# Altium schematic sheet TIDA-01592_Power Supply1.SchDoc: Power Supply
size 431 x 279 mm; Date: Not shown in title block; ApprovedBy: Not shown in title block; CheckedBy: Not shown in title block; Author: Not shown in title block; CompanyName: Not shown in title block; DrawnBy: Abhishek Vishwa; Engineer: Abhishek Vishwa; Organization: Not shown in title block; Address1: Not shown in title block; Address2: Not shown in title block; Address3: Not shown in title block; Address4: Not shown in title block; DocumentNumber: 1; Revision: Use project parameter SCH_Rev; SheetNumber: 2; SheetTotal: 5; PageSetup: Record=PageOptions|CenterHorizontal=True|CenterVertical=True|PrintScale=1.00|XCorrection=1.00|YCorrection=1.00|PrintKind=0|BorderSize=5000000|LeftOffset=0|BottomOffset=0|Orientation=2|PaperLength=1000|PaperWidth=1000|Scale=100|PaperSource=15|PrintQuality=600|MediaType=1|DitherType=10|PaperKind=Letter|PrintScaleMode=1; CurrentTime: Not shown in title block; CurrentDate: Not shown in title block; Time: Not shown in title block; DocumentFullPathAndName: Not shown in title block; DocumentName: Not shown in title block; ModifiedDate: Not shown in title block; ImagePath: Not shown in title block; ProjectName: HV PS for Transmitter
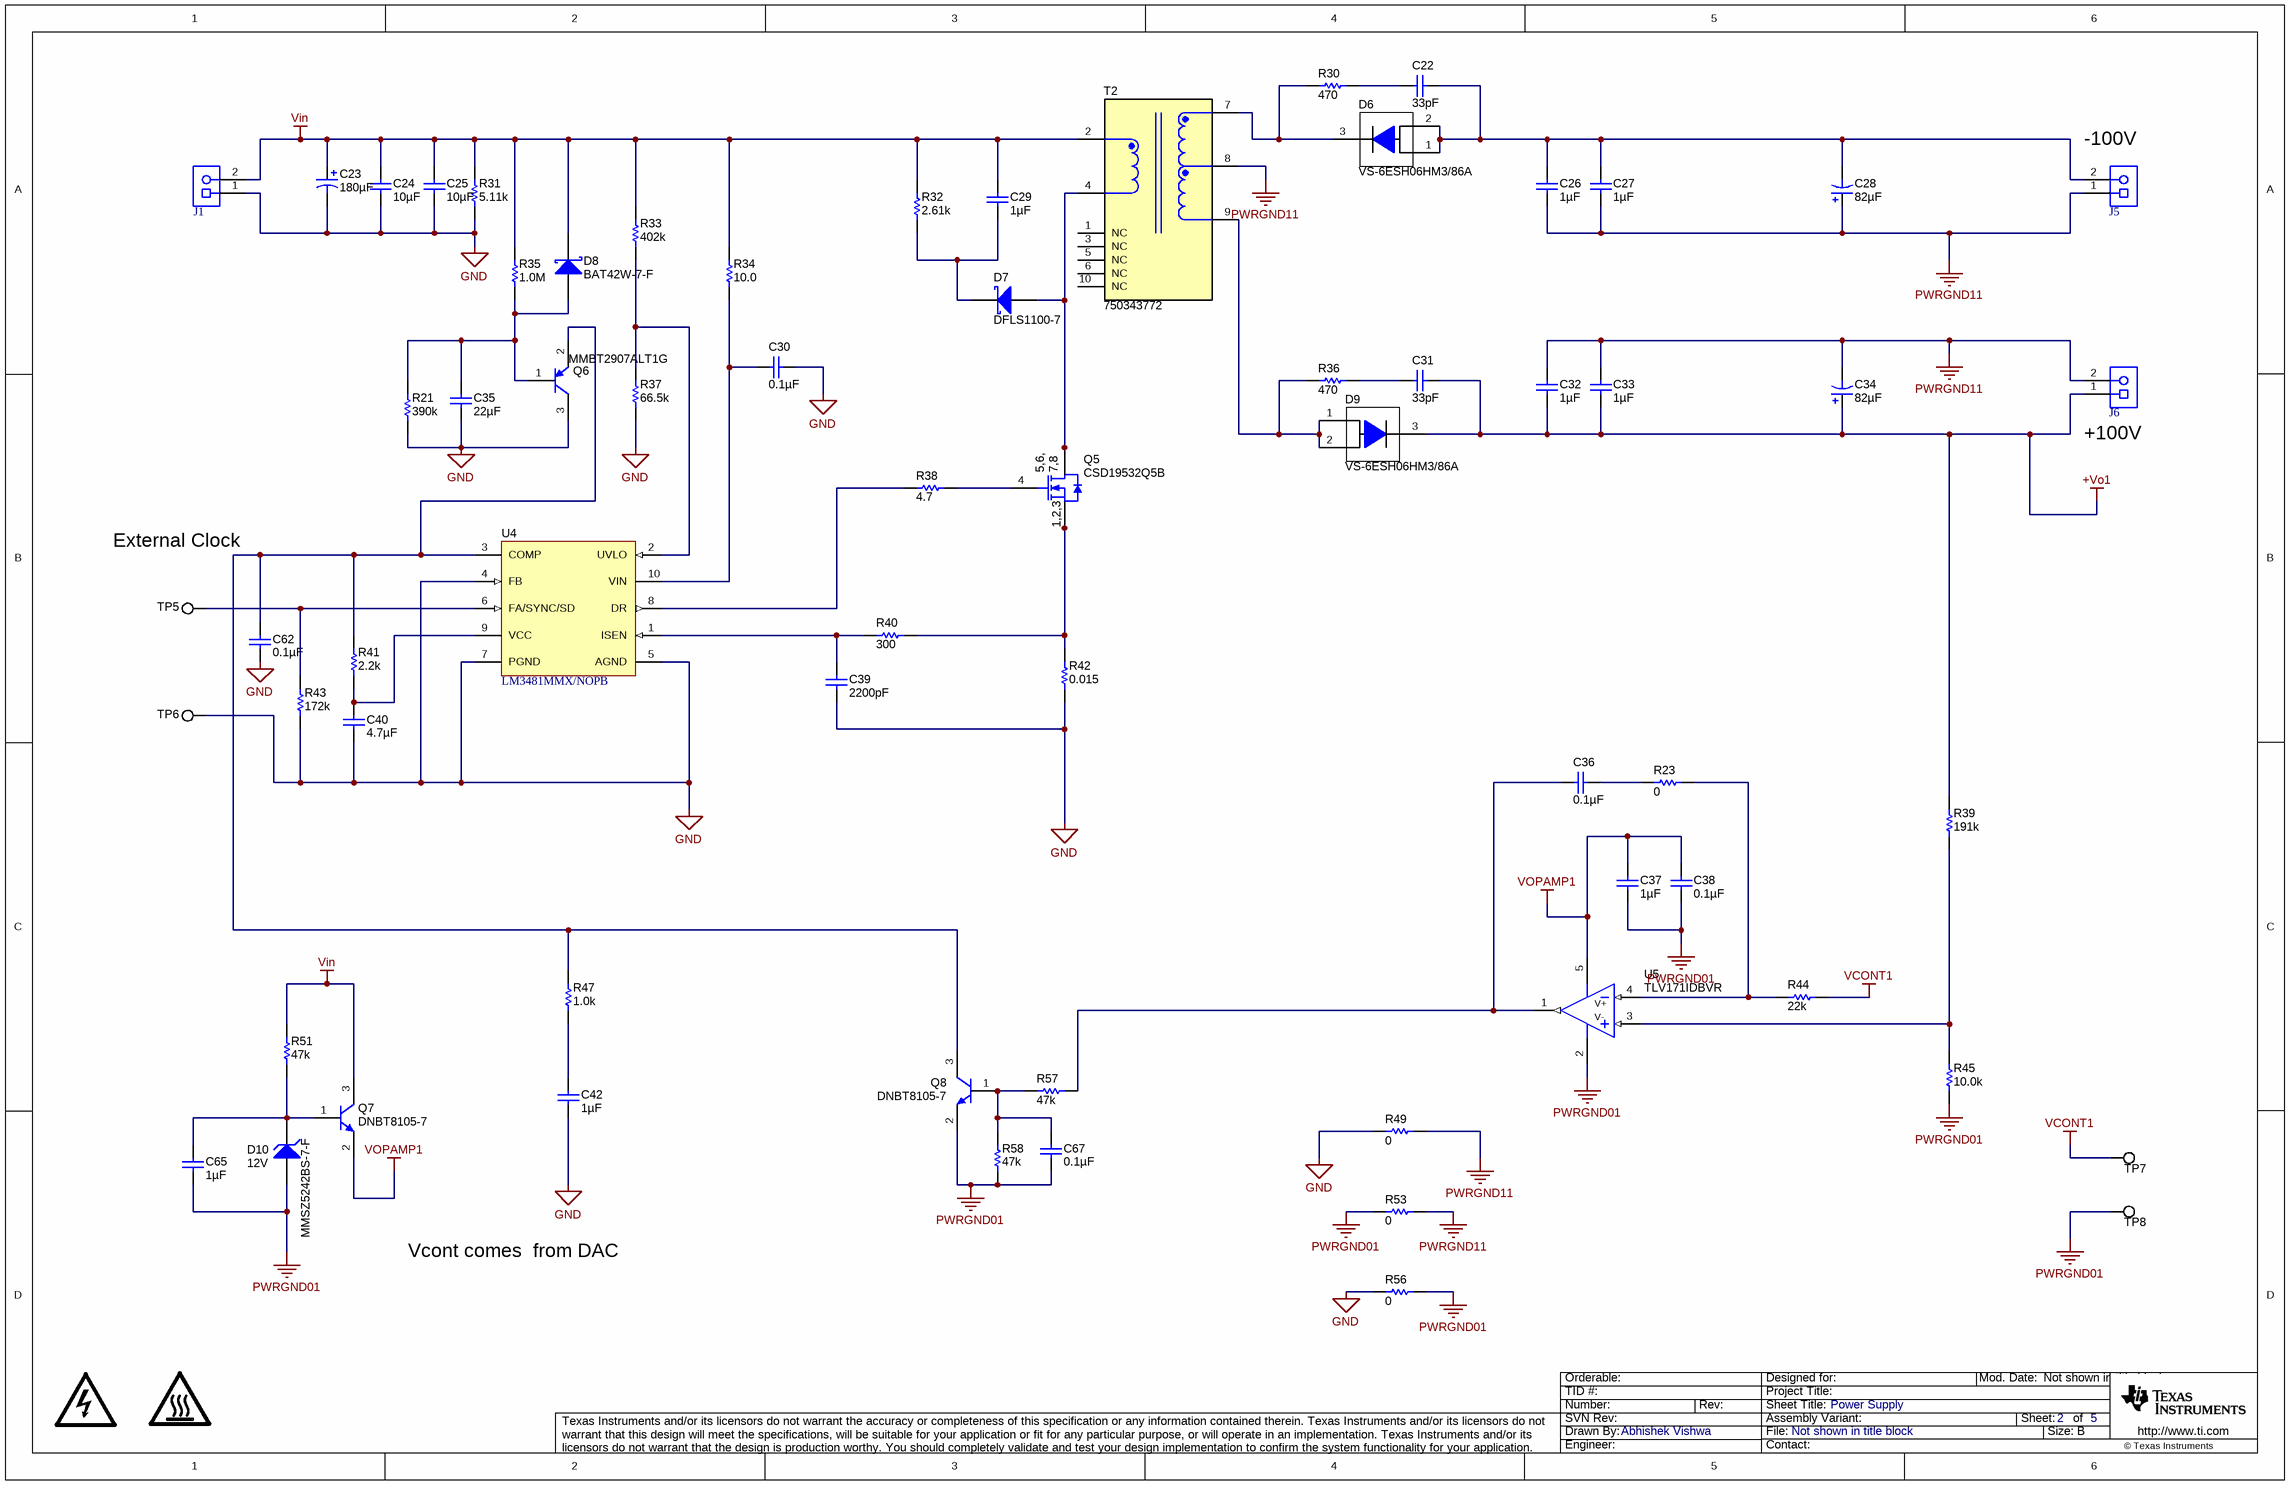
[diagram p0: TIDA-01592_Power Supply1.SchDoc]

## Parts
C22  ValueDisplayed: 33pF  [1206]  (hidden comment: 12067A330JAT2A)
C23  ValueDisplayed: 180µF  [FC_630x1120]  (hidden comment: 35TXW180MEFC6.3X25)
C24  ValueDisplayed: 10µF  [1206_180]  (hidden comment: GRM31CR61H106KA12L)
C25  ValueDisplayed: 10µF  [1206_180]  (hidden comment: GRM31CR61H106KA12L)
C26  ValueDisplayed: 1µF  [1812_180]  (hidden comment: C4532X7T2E105M250KE)
C27  ValueDisplayed: 1µF  [1812_180]  (hidden comment: C4532X7T2E105M250KE)
C28  ValueDisplayed: 82µF  [NHG_1000x2000]  (hidden comment: UCY2C820MPD9)
C29  ValueDisplayed: 1µF  [1206_180]  (hidden comment: GRM31CR72A105KA01L)
C30  ValueDisplayed: 0.1µF  [0603]  (hidden comment: GRM188R71H104KA93D)
C31  ValueDisplayed: 33pF  [1206]  (hidden comment: 12067A330JAT2A)
C32  ValueDisplayed: 1µF  [1812_180]  (hidden comment: C4532X7T2E105M250KE)
C33  ValueDisplayed: 1µF  [1812_180]  (hidden comment: C4532X7T2E105M250KE)
C34  ValueDisplayed: 82µF  [NHG_1000x2000]  (hidden comment: UCY2C820MPD9)
C35  ValueDisplayed: 22µF  [0805_HV1]  (hidden comment: C2012X5R1V226M125AC)
C36  ValueDisplayed: 0.1µF  [0603]  (hidden comment: GRM188R71H104KA93D)
C37  ValueDisplayed: 1µF  [0603]  (hidden comment: UMK107AB7105KA-T)
C38  ValueDisplayed: 0.1µF  [0603]  (hidden comment: GRM188R71H104KA93D)
C39  ValueDisplayed: 2200pF  [0402]  (hidden comment: GRM155R61H222KA01D)
C40  ValueDisplayed: 4.7µF  [0603]  (hidden comment: 0603ZD475KAT2A)
C42  ValueDisplayed: 1µF  [0603]  (hidden comment: C0603C105K3RACTU)
C62  ValueDisplayed: 0.1µF  [0603]  (hidden comment: GRM188R71H104KA93D)
C65  ValueDisplayed: 1µF  [0603]  (hidden comment: C0603C105K3RACTU)
C67  ValueDisplayed: 0.1µF  [0603]  (hidden comment: GRM188R71H104KA93D)
D6  VS-6ESH06HM3/86A  [TO-277A]
D7  DFLS1100-7  [PowerDI123]
D8  BAT42W-7-F  [SOD-123]
D9  VS-6ESH06HM3/86A  [TO-277A]
D10  MMSZ5242BS-7-F  value 12V  [SOD-323]
J1  1727010  [PhoenixConact_1727010]  (value not drawn)
J5  1727010  [PhoenixConact_1727010]  (value not drawn)
J6  1727010  [PhoenixConact_1727010]  (value not drawn)
LOGO2  CAUTION HOT SURFACE  [IEC_HotSurface_Small]  (value not drawn)  (graphical)
LOGO8  DANGER HIGH VOLTAGE  [IEC_HighVoltage_Small]  (value not drawn)  (graphical)
Q5  CSD19532Q5B  [DNK0008A]
Q6  MMBT2907ALT1G  [SOT-23]
Q7  DNBT8105-7  [SOT-23]
Q8  DNBT8105-7  [SOT-23]
R21  ValueDisplayed: 390k  [0603]  (hidden comment: CRCW0603390KJNEA)
R23  ValueDisplayed: 0  [0402]  (hidden comment: CRCW04020000Z0ED)
R30  ValueDisplayed: 470  [1206]  (hidden comment: CRCW1206470RJNEA)
R31  ValueDisplayed: 5.11k  [TNPW0603]  (hidden comment: TNPW06035K11BEEA)
R32  ValueDisplayed: 2.61k  [2010]  (hidden comment: CRCW20102K61FKEF)
R33  ValueDisplayed: 402k  [0603]  (hidden comment: CRCW0603402KFKEA)
R34  R4: 10.0  [0603]  (hidden comment: CRCW060310R0FKEAHP)
R35  ValueDisplayed: 1.0M  [0603]  (hidden comment: CRCW06031M00JNEA)
R36  ValueDisplayed: 470  [1206]  (hidden comment: CRCW1206470RJNEA)
R37  ValueDisplayed: 66.5k  [0603]  (hidden comment: CRCW060366K5FKEA)
R38  ValueDisplayed: 4.7  [0603]  (hidden comment: CRCW06034R70JNEA)
R39  ValueDisplayed: 191k  [0603]  (hidden comment: CRCW0603191KFKEA)
R40  ValueDisplayed: 300  [0603]  (hidden comment: CRCW0603300RJNEA)
R41  ValueDisplayed: 2.2k  [0603]  (hidden comment: ERJ-3GEYJ222V)
R42  ValueDisplayed: 0.015  [2010]  (hidden comment: WSL2010R0150FEA18)
R43  ValueDisplayed: 172k  [0603]  (hidden comment: RT0603DRE07172KL)
R44  ValueDisplayed: 22k  [0603]  (hidden comment: CRCW060322K0JNEA)
R45  ValueDisplayed: 10.0k  [0603]  (hidden comment: CRCW060310K0FKEA)
R47  ValueDisplayed: 1.0k  [0603]  (hidden comment: CRCW06031K00JNEA)
R49  ValueDisplayed: 0  [2010L]  (hidden comment: CRCW20100000Z0EF)
R51  ValueDisplayed: 47k  [1206]  (hidden comment: CRCW120647K0JNEA)
R53  ValueDisplayed: 0  [2010L]  (hidden comment: CRCW20100000Z0EF)
R56  ValueDisplayed: 0  [2010L]  (hidden comment: CRCW20100000Z0EF)
R57  ValueDisplayed: 47k  [0603]  (hidden comment: RC0603JR-0747KL)
R58  ValueDisplayed: 47k  [0603]  (hidden comment: RC0603JR-0747KL)
T2  750343772  [Wurth_EE16_7_5_5278]
TP5  5002  [Keystone5002]  (value not drawn)
TP6  5002  [Keystone5002]  (value not drawn)
TP7  5002  [Keystone5002]  (value not drawn)
TP8  5002  [Keystone5002]  (value not drawn)
U4  LM3481MMX/NOPB  [MUB10A_N]
U5  TLV171IDBVR  [DBV0005A_N]

## Nets
+Vo1: C31.1 C32.2 C33.2 C34.1(+) D9.3(K) J6.1 R39.2
GND: C23.2(-) C24.2 C25.2 C30.1 C35.2 C39.2 C40.2 C42.2 C62.1 J1.1 Q6.3(C) R21.1 R31.1 R37.1 R42.1 R43.1 R49.1 R56.1 TP6.1 U4.4(FB) U4.5(AGND) U4.7(PGND)
PWRGND01: C37.2 C38.2 C65.2 C67.1 D10.2(A) Q8.2(E) R45.2 R53.1 R56.2 R58.2 TP8.1 U5.2(V-)
PWRGND11: C26.2 C27.2 C28.1(+) C32.1 C33.1 C34.2(-) J5.1 J6.2 R49.2 R53.2 T2.8
VCONT1: R44.2 TP7.1
Vin: C23.1(+) C24.1 C25.1 C29.1 D8.1(K) J1.2 Q7.3(C) R31.2 R32.2 R33.2 R34.1 R35.2 R51.2 T2.2
VOPAMP1: C37.1 C38.1 Q7.2(E) U5.5(V+)
NetC22_1: C22.1 C26.1 C27.1 C28.2(-) D6.1(A) D6.2(A) J5.2
NetC22_2: C22.2 R30.2
NetC29_2: C29.2 D7.1(K) R32.1
NetC30_2: C30.2 R34.2 U4.10(VIN)
NetC31_2: C31.2 R36.2
NetC35_1: C35.1 D8.2(A) Q6.1(B) R21.2 R35.1
NetC36_1: C36.1 R57.1 U5.1(OUT)
NetC36_2: C36.2 R23.1
NetC39_1: C39.1 R40.1 U4.1(ISEN)
NetC40_1: C40.1 R41.2 U4.9(VCC)
NetC42_1: C42.1 R47.1
NetC62_2: C62.2 Q6.2(E) Q8.3(C) R41.1 R47.2 U4.3(COMP)
NetC65_1: C65.1 D10.1(K) Q7.1(B) R51.1
NetC67_2: C67.2 Q8.1(B) R57.2 R58.1
NetD6_3: D6.3(K) R30.1 T2.7
NetD7_2: D7.2(A) Q5.5(D) Q5.6(D) Q5.7(D) Q5.8(D) Q5.9(D) T2.4
NetD9_1: D9.1(A) D9.2(A) R36.1 T2.9
NetQ5_1: Q5.1(S) Q5.2(S) Q5.3(S) R40.2 R42.2
NetQ5_4: Q5.4(G) R38.2
NetR23_2: R23.2 R44.1 U5.4(IN-)
NetR33_1: R33.1 R37.2 U4.2(UVLO)
NetR38_1: R38.1 U4.8(DR)
NetR39_1: R39.1 R45.1 U5.3(IN+)
NetR43_2: R43.2 TP5.1 U4.6(FA/SYNC/SD)

Not connected (* = marked no-connect by the designer): T2 1(NC) 3(NC) 5(NC) 6(NC) 10(NC)

## Notes on the sheet
- (near J5) -100V
- (near J6) +100V
- External Clock Synchronization
- Vcont comes  from DAC
- Drawn By:
- SVN Rev:
- Number:
- TID #:
- Orderable:
- Rev:
- Sheet Title:
- File:
- Project Title:
- Designed for:
- Assembly Variant:
- Mod. Date:
- Sheet:
- Size:
- of
- B
- http://www.ti.com
- Texas Instruments and/or its licensors do not warrant the accuracy or completeness of this specification or any information contained therein. Texas Instruments and/or its licensors do not warrant that this design will meet the specifications, will be suitable for your application or fit for any particular purpose, or will operate in an implementation. Texas Instruments and/or its licensors do not warrant that the design is production worthy. You should completely validate and test your design implementation to confirm the system functionality for your application.
- Engineer:
- Contact:
- © Texas Instruments
- (in symbol CSD19532Q5B) 5,6,; 7,8; 1,2,3

## Library data of the parts
C22 C31 = 12067A330JAT2A: CAP, CERM, 33 pF, 500 V,+/- 5%, C0G/NP0, 1206; Manufacturer: AVX; Polarized: N; CompType: Capacitor; Value: 33pF; U/M: EA; Cap_F: 0.000000000033; Tolerance_%: 5; VDC_V: 500; Value2: 500V; TaMin_C: -55; TaMax_C: 125; SizeArea_mm2: 5.12; SizeAreaWB_mm2: 10.92; SizeX_mm: 3.2; SizeY_mm: 1.6; SizeZ_mm: 1.35; AEC Category: Q200; Green_Lifecycle: Not Set; Green_REACh: Incomplete; SymbolVersion: 2008-07-09; PartNumber: 12067A330JAT2A; PackageReference: 1206; RoHS: Y; MountType: SMT; Technology: Ceramic; TempCo: C0G/NP0; Cap_Case: 1206; Published: 2008-06-19; Publisher: Texas Instruments; LatestRevisionDate: 2017-06-22; ComponentLink1Description: Datasheet link; ComponentLink1URL: http://partbuilder.avx.com/p/pb/pdf/1027/C0GNP0-Dielectric.pdf; Supplier 1: Digi-Key; Supplier Part Number 1: 12067A330JAT2A-ND; Supplier 2: Newark; Supplier Part Number 2: 55J9805; Supplier 3: Mouser; Supplier Part Number 3: 581-12067A330JAT2A; AEC Qualified: N; AEC Grade: N/A; Green_EU RoHS: Incomplete; Green_EU RoHS-2: Incomplete
C23 = EEU-FC1V470: CAP, AL, 180 µF, 35 V, +/- 20%, TH; Manufacturer: Rubycon; Polarized: Y; CompType: Capacitor; Value: 180uF; U/M: EA; Cap_F: 0.000180; Tolerance_%: 20; VDC_V: 35; Value2: 35V; IRMS_A: 0.29; TaMin_C: -55; TaMax_C: 105; Cap_Case: 6.3x11.2mm; SizeAreaWB_mm2: 68.89; SizeArea_mm2: 39.69; SizeX_mm: 6.3; SizeZ_mm: 12.2; AEC Category: Q200; AEC Grade: 2; SymbolVersion: 2008-07-09; PartNumber: 35TXW180MEFC6.3X25; RoHS: Y; MountType: TH; Technology: AL; Series: FC; SizeY_mm: 6.3; Publisher: Texas Instruments; LatestRevisionDate: 2017-06-22; Supplier 1: Digi-Key; Supplier Part Number 1: 35TXW180MEFC6.3X25-ND; AEC Qualified: Y
C24 C25 = GRM31CR61H106KA12L: CAP, CERM, 10 µF, 50 V,+/- 10%, X5R, 1206; Manufacturer: MuRata; Polarized: N; CompType: Capacitor; Value: 10uF; U/M: EA; Cap_F: 0.00001; Tolerance_%: 10; VDC_V: 50; Value2: 50V; TaMin_C: -55; TaMax_C: 85; Cap_Case: 1206; SizeArea_mm2: 5.12; SizeAreaWB_mm2: 10.92; SizeX_mm: 3.2; SizeY_mm: 1.6; SizeZ_mm: 1.8; AEC Category: Q200; Green_Lifecycle: Active; Green_REACh: Passed; SymbolVersion: 2008-07-09; PartNumber: GRM31CR61H106KA12L; PackageReference: 1206; RoHS: Y; MountType: SMT; Technology: Ceramic; TempCo: X5R; Published: 2008-06-19; Publisher: Texas Instruments; LatestRevisionDate: 2017-06-22; ComponentLink1Description: Datasheet link; ComponentLink1URL: http://search.murata.co.jp/Ceramy/image/img/A01X/G101/ENG/GRM31CR61H106KA12-01.pdf; Supplier 1: Digi-Key; Supplier Part Number 1: 490-5961-1-ND; Supplier 2: Newark; Supplier Part Number 2: 13T1214; Supplier 3: Mouser; Supplier Part Number 3: 81-GRM31CR61H106KA2L; AEC Qualified: N; AEC Grade: N/A; Green_EU RoHS: Passed; Green_EU RoHS-2: Incomplete
C26 C27 C32 C33 = C4532X7R1H105K160KA: CAP, CERM, 1 µF, 250 V,+/- 20%, X7T, 1812; Manufacturer: TDK Corporation; Polarized: N; CompType: Capacitor; Value: 1uF; U/M: EA; Cap_F: 0.000001; Tolerance_%: 20; ESR_ohm: 0.007217; Value1: 0.007217 ohm; VDC_V: 50; Value2: 250V; IRMS_A: 2.85919; TaMin_C: -55; TaMax_C: 125; Cap_Case: 1812; SizeArea_mm2: 14.4; SizeAreaWB_mm2: 23.1; SizeX_mm: 4.5; SizeY_mm: 3.2; SizeZ_mm: 1.8; AEC Category: Q200; SymbolVersion: 2008-07-09; PartNumber: C4532X7T2E105M250KE; PackageReference: 1812; RoHS: Y; MountType: SMT; Technology: Ceramic; TempCo: X7T; Published: 2008-06-19; Publisher: Texas Instruments; LatestRevisionDate: 2017-06-22; ComponentLink1Description: Datasheet link; ComponentLink1URL: https://product.tdk.com/en/search/capacitor/ceramic/mlcc/info?part_no=C4532X7R1H105K160KA; Supplier 1: Digi-Key; Supplier Part Number 1: 445-6835-2-ND; Supplier 2: Mouser; Supplier Part Number 2: C4532X7T2E105M250KE; AEC Qualified: N; AEC Grade: N/A
C28 C34 = ECA-2AHG101: CAP, AL, 82 µF, 160 V, +/- 20%, TH; Manufacturer: Nichicon; Polarized: Y; CompType: Capacitor; Value: 82uF; U/M: EA; Cap_F: 0.0001; Tolerance_%: 20; VDC_V: 160; Value2: 160V; IRMS_A: 0.265; TaMin_C: -55; TaMax_C: 105; Cap_Case: 10x20mm; SizeAreaWB_mm2: 144; SizeArea_mm2: 100; SizeX_mm: 10; SizeZ_mm: 22; AEC Category: Q200; Green_Lifecycle: Active; Green_REACh: Passed; SymbolVersion: 2008-07-09; PartNumber: UCY2C820MPD9; PackageReference: 10x20mm; RoHS: Y; MountType: TH; Technology: AL; Series: NHG; SizeY_mm: 10; Publisher: Texas Instruments; LatestRevisionDate: 2017-06-22; Supplier 1: Digi-Key; Supplier Part Number 1: 493-6989-ND; AEC Qualified: ?; Green_EU RoHS: Passed; Green_EU RoHS-2: Passed
C29 = GRM31CR72A105KA01L: CAP, CERM, 1 µF, 100 V,+/- 10%, X7R, 1206; Manufacturer: MuRata; Polarized: N; CompType: Capacitor; Value: 1uF; U/M: EA; Cap_F: 0.000001; Tolerance_%: 10; VDC_V: 100; Value2: 100V; TaMin_C: -55; TaMax_C: 125; Cap_Case: 1206; SizeArea_mm2: 5.12; SizeAreaWB_mm2: 10.92; SizeX_mm: 3.2; SizeY_mm: 1.6; SizeZ_mm: 1.8; AEC Category: Q200; Green_Lifecycle: Active; Green_REACh: Passed; SymbolVersion: 2008-07-09; PartNumber: GRM31CR72A105KA01L; PackageReference: 1206; RoHS: Y; MountType: SMT; Technology: Ceramic; TempCo: X7R; Published: 2008-06-19; Publisher: Texas Instruments; LatestRevisionDate: 2017-06-22; ComponentLink1Description: Datasheet link; ComponentLink1URL: http://search.murata.co.jp/Ceramy/PnsearchViewAction.do?HnOFG=ON&HnNFG=ON&SEL_CNT=50&sLang=en&sKey=GRM31CR72A105KA01L&x=9&y=9&search=startwith; Supplier 1: Digi-Key; Supplier Part Number 1: 490-3909-1-ND; Supplier 2: Mouser; Supplier Part Number 2: 81-GRM31CR72A105KA01; Supplier 3: Farnell; Supplier Part Number 3: 1735543; AEC Qualified: ?; Green_EU RoHS: Passed; Green_EU RoHS-2: Incomplete
C30 C36 C38 C62 C67 = GRM188R71H104KA93D: CAP, CERM, 0.1 µF, 50 V,+/- 10%, X7R, 0603; Manufacturer: MuRata; Polarized: N; CompType: Capacitor; Value: 0.1uF; U/M: EA; Cap_F: 0.0000001; Tolerance_%: 10; VDC_V: 50; Value2: 50V; TaMin_C: -55; TaMax_C: 125; SizeArea_mm2: 1.28; SizeAreaWB_mm2: 4.68; SizeX_mm: 1.6; SizeY_mm: 0.8; SizeZ_mm: 1; AEC Category: Q200; Green_Lifecycle: Active; Green_REACh: Passed; SymbolVersion: 2008-07-09; PartNumber: GRM188R71H104KA93D; PackageReference: 0603; RoHS: Y; MountType: SMT; Technology: Ceramic; TempCo: X7R; Cap_Case: 0603; Published: 2008-06-19; Publisher: Texas Instruments; LatestRevisionDate: 2017-06-22; ComponentLink1Description: Datasheet link; ComponentLink1URL: http://search.murata.co.jp/Ceramy/PnsearchViewAction.do?HnOFG=ON&HnNFG=ON&SEL_CNT=50&sLang=en&sKey=GRM188R71H104KA93D&x=9&y=9&search=startwith; Supplier 1: Digi-Key; Supplier Part Number 1: 490-1519-1-ND; Supplier 2: Mouser; Supplier Part Number 2: 81-GRM39X104K50D; Supplier 3: Farnell; Supplier Part Number 3: 8820023; AEC Qualified: ?; Green_EU RoHS: Passed; Green_EU RoHS-2: Incomplete
C35 = GRM21BC81C226ME44L: CAP, CERM, 22 µF, 35 V,+/- 20%, X5R, 0805; Manufacturer: TDK Corporation; Polarized: N; CompType: Capacitor; Value: 22uF; U/M: EA; Cap_F: 0.000022; Tolerance_%: 20; VDC_V: 16; Value2: 35V; TempCo: X6S; TaMin_C: -55; TaMax_C: 105; Cap_Case: 0805; SizeArea_mm2: 2.5; SizeAreaWB_mm2: 6.75; SizeX_mm: 2; SizeY_mm: 1.25; SizeZ_mm: 1.45; AEC Category: Q200; SymbolVersion: 2008-07-09; PartNumber: C2012X5R1V226M125AC; PackageReference: 0805; RoHS: Y; MountType: SMT; Technology: Ceramic; Published: 2008-06-19; Publisher: Texas Instruments; LatestRevisionDate: 2017-06-22; ComponentLink1Description: Datasheet link; ComponentLink1URL: http://psearch.en.murata.com/capacitor/product/GRM21BC81C226ME44%23.pdf; Supplier 1: Digi-Key; Supplier Part Number 1: 445-14428-2-ND; Supplier 2: Newark; Supplier Part Number 2: C2012X5R1V226M125AC; Supplier 3: Mouser; Supplier Part Number 3: C2012X5R1V226M125AC; AEC Qualified: N; AEC Grade: N/A
C37 = UMK107AB7105KA-T: CAP, CERM, 1 µF, 50 V,+/- 10%, X7R, 0603; Manufacturer: Taiyo Yuden; Polarized: N; CompType: Capacitor; Value: 1uF; U/M: EA; Cap_F: 0.000001; Tolerance_%: 10; VDC_V: 50; Value2: 50V; TaMin_C: -55; TaMax_C: 125; SizeArea_mm2: 1.28; SizeAreaWB_mm2: 4.68; SizeX_mm: 1.6; SizeY_mm: 0.8; SizeZ_mm: 1; AEC Category: Q200; Green_Lifecycle: Active; Green_REACh: Passed; SymbolVersion: 2008-07-09; PartNumber: UMK107AB7105KA-T; PackageReference: 0603; RoHS: Y; MountType: SMT; Technology: Ceramic; TempCo: X7R; Cap_Case: 0603; Published: 2008-06-19; Publisher: Texas Instruments; LatestRevisionDate: 2017-06-22; ComponentLink1Description: Datasheet link; ComponentLink1URL: http://www.yuden.co.jp/ut/product/category/capacitor/UMK107AB7105KA-T.pdf; Supplier 1: Digi-Key; Supplier Part Number 1: 587-3247-1-ND; Supplier 2: Newark; Supplier Part Number 2: 45W1781; Supplier 3: Mouser; Supplier Part Number 3: 963-UMK107AB7105KA-T; AEC Qualified: ?; Green_EU RoHS: Passed; Green_EU RoHS-2: Passed
C39 = GRM155R61H222KA01D: CAP, CERM, 2200 pF, 50 V,+/- 10%, X5R, 0402; Manufacturer: MuRata; Polarized: N; CompType: Capacitor; Value: 2200pF; U/M: EA; Cap_F: 0.0000000022; Tolerance_%: 10; VDC_V: 50; Value2: 50V; TaMin_C: -55; TaMax_C: 85; SizeArea_mm2: 0.5; SizeAreaWB_mm2: 3; SizeX_mm: 1; SizeZ_mm: 0.6; AEC Category: Q200; Green_Lifecycle: Active; Green_REACh: Passed; SymbolVersion: 2008-07-09; PartNumber: GRM155R61H222KA01D; PackageReference: 0402; RoHS: Y; MountType: SMT; Technology: Ceramic; TempCo: X5R; Cap_Case: 0402; SizeY_mm: 0.5; Published: 2008-06-19; Publisher: Texas Instruments; LatestRevisionDate: 2017-06-22; ComponentLink1Description: Datasheet link; ComponentLink1URL: http://search.murata.co.jp/Ceramy/PnsearchViewAction.do?HnOFG=ON&HnNFG=ON&SEL_CNT=50&sLang=en&sKey=GRM155R61H222KA01D&x=9&y=9&search=startwith; Supplier 1: Digi-Key; Supplier Part Number 1: GRM155R61H222KA01D-ND; Supplier 2: Mouser; Supplier Part Number 2: 81-GRM155R61H222KA1D; AEC Qualified: ?; Green_EU RoHS: Passed; Green_EU RoHS-2: Incomplete
C40 = 0603ZD475KAT2A: CAP, CERM, 4.7 µF, 10 V,+/- 10%, X5R, 0603; Manufacturer: AVX; Polarized: N; CompType: Capacitor; Value: 4.7uF; U/M: EA; Cap_F: 0.0000047; Tolerance_%: 10; Value2: 10V; TaMin_C: -55; TaMax_C: 85; SizeArea_mm2: 1.28; SizeAreaWB_mm2: 4.68; SizeX_mm: 1.6; SizeY_mm: 0.8; SizeZ_mm: 1; AEC Category: Q200; Green_Lifecycle: Active; Green_REACh: Passed; SymbolVersion: 2008-07-09; PartNumber: 0603ZD475KAT2A; PackageReference: 0603; RoHS: Y; VDC_V: 10; MountType: SMT; Technology: Ceramic; TempCo: X5R; Cap_Case: 0603; Published: 2008-06-19; Publisher: Texas Instruments; LatestRevisionDate: 2017-06-22; ComponentLink1Description: Datasheet link; ComponentLink1URL: http://datasheets.avx.com/cx5r.pdf; Supplier 1: Digi-Key; Supplier Part Number 1: 478-7943-1-ND; Supplier 2: Newark; Supplier Part Number 2: 85R5666; Supplier 3: Mouser; Supplier Part Number 3: 581-0603ZD475KAT2A; AEC Qualified: N; AEC Grade: N/A; Green_EU RoHS: Passed; Green_EU RoHS-2: Incomplete
C42 C65 = C0603C105K3RACTU: CAP, CERM, 1 µF, 25 V,+/- 10%, X7R, 0603; Manufacturer: Kemet; Polarized: N; CompType: Capacitor; Value: 1uF; U/M: EA; Cap_F: 0.000001; Tolerance_%: 10; VDC_V: 25; Value2: 25V; TaMin_C: -55; TaMax_C: 125; SizeArea_mm2: 1.28; SizeAreaWB_mm2: 4.68; SizeX_mm: 1.6; SizeY_mm: 0.8; SizeZ_mm: 1; AEC Category: Q200; Green_Lifecycle: Active; Green_REACh: Passed; SymbolVersion: 2008-07-09; PartNumber: C0603C105K3RACTU; PackageReference: 0603; RoHS: Y; MountType: SMT; Technology: Ceramic; TempCo: X7R; Cap_Case: 0603; Published: 2008-06-19; Publisher: Texas Instruments; LatestRevisionDate: 2017-06-22; ComponentLink1Description: Datasheet link; ComponentLink1URL: http://capacitoredge.kemet.com/capedge2/DataSheet/Datasheet-C0603C105K3RACTU.pdf?pn=C0603C105K3RACTU; Supplier 1: Digi-Key; Supplier Part Number 1: 399-7376-1-ND; Supplier 2: Newark; Supplier Part Number 2: 24W4858; Supplier 3: Mouser; Supplier Part Number 3: 80-C0603C105K3R; AEC Qualified: ?; Green_EU RoHS: Passed; Green_EU RoHS-2: Passed
D6 D9 = VS-6ESH06HM3/86A: Diode, Hyperfast, 600 V, 6 A, AEC-Q101, TO-277A; Manufacturer: Vishay-Semiconductor; SymbolCreator: a0412235; U/M: EA; Vf_V: 1.05; Value: 600V; Value1: 6A; Value2: 1.05V; Io_A: 6; Vr_V: 600; TJmax_C: 175; RJC_CperW: 3.5; SizeAreaWB_mm2: 57.375; SizeArea_mm2: 30.875; SizeX_mm: 6.5; SizeY_mm: 4.75; SizeZ_mm: 1.2; AEC Category: Q101; AEC Qualified: Y; SymbolVersion: 2013-01-13; PartNumber: VS-6ESH06HM3/86A; PackageReference: TO-277A; CompType: Diode; MountType: SMT; Type: Hyperfast; RoHS: Y; Published: 2008-06-26; Publisher: Texas Instruments; LatestRevisionDate: 2017-06-26; ComponentLink1Description: Datasheet link; ComponentLink1URL: http://www.vishay.com/docs/94985/vs-6esh06hm3.pdf; Supplier 1: Digi-Key; Supplier Part Number 1: VS-6ESH06HM3/86AGICT-ND; Supplier 2: Newark; Supplier Part Number 2: 45Y8966; Supplier 3: Mouser; Supplier Part Number 3: 78-VS-6ESH06HM3/86A
D7 = DFLS1100-7: Diode, Schottky, 100 V, 1 A, PowerDI123; Manufacturer: Diodes Inc.; U/M: EA; Vf_V: 0.77; Value: 100V; Value1: 1A; Value2: 0.77V; Io_A: 1; Vr_V: 100; TJmax_C: 175; RJC_CperW: 7; SizeAreaWB_mm2: 13.066; SizeArea_mm2: 6.586; SizeX_mm: 3.7; SizeY_mm: 1.78; SizeZ_mm: 0.98; AEC Category: Q101; Green_Lifecycle: Active; Green_REACh: Passed; CompType: Diode; SymbolVersion: 2008-12-08; PartNumber: DFLS1100-7; PackageReference: PowerDI123; MountType: SMT; Type: Schottky; RoHS: Y; Published: 2008-06-26; Publisher: Texas Instruments; LatestRevisionDate: 2017-06-26; ComponentLink1Description: Datasheet link; ComponentLink1URL: http://www.diodes.com/datasheets/ds30497.pdf; Supplier 1: Digi-Key; Supplier Part Number 1: DFLS1100DICT-ND; Supplier 2: Mouser; Supplier Part Number 2: 621-DFLS1100-7; Supplier 3: Farnell; Supplier Part Number 3: 1713889; AEC Qualified: ?; Green_EU RoHS: Passed with Exemption; Green_EU RoHS-2: Passed
D8 = BAT42W-7-F: Diode, Schottky, 30 V, 0.2 A, SOD-123; Manufacturer: Diodes Inc.; U/M: EA; Vf_V: 1; Value: 30V; Value1: 0.2A; Value2: 1V; Io_A: 0.2; Vr_V: 30; SizeAreaWB_mm2: 13.095; SizeArea_mm2: 6.545; SizeX_mm: 3.85; SizeY_mm: 1.7; SizeZ_mm: 1.35; AEC Category: Q101; Green_Lifecycle: Not Set; Green_REACh: Incomplete; CompType: Diode; SymbolVersion: 2008-12-08; PartNumber: BAT42W-7-F; PackageReference: SOD-123; MountType: SMT; Type: Schottky; RoHS: Y; Published: 2008-06-26; Publisher: Texas Instruments; LatestRevisionDate: 2017-06-26; ComponentLink1Description: Datasheet link; ComponentLink1URL: http://www.diodes.com/datasheets/ds30016.pdf; Supplier 1: Digi-Key; Supplier Part Number 1: BAT42WDICT-ND; Supplier 2: Mouser; Supplier Part Number 2: 621-BAT42W-F; Supplier 3: Farnell; Supplier Part Number 3: 1843718; AEC Qualified: ?; Green_EU RoHS: Incomplete; Green_EU RoHS-2: Incomplete
D10 = MMSZ5242BS-7-F: Diode, Zener, 12 V, 200 mW, SOD-323; Manufacturer: Diodes Inc.; SymbolCreator: a0412235; U/M: EA; Power_W: 0.2; Vz_V: 12; Value1: 0.2W; RJA_CperW: 350; SizeAreaWB_mm2: 8.695; SizeArea_mm2: 3.645; SizeX_mm: 2.7; SizeY_mm: 1.35; SizeZ_mm: 1; AEC Category: Q101; SymbolVersion: 2010-08-25; PartNumber: MMSZ5242BS-7-F; PackageReference: SOD-323; CompType: Zener; Vr_V: N/A; MountType: SMT; RoHS: Y; ComponentLink1Description: Datasheet link; ComponentLink1URL: http://www.diodes.com/datasheets/ds31038.pdf; Published: 2008-10-08; Publisher: Texas Instruments; LatestRevisionDate: 2017-06-20; LatestRevisionNote: Updated Supplier Data; Supplier 1: Digi-Key; Supplier Part Number 1: MMSZ5242BS-FDICT-ND; Supplier 2: Mouser; Supplier Part Number 2: 621-MMSZ5242BS-F; AEC Qualified: ?
J1 J5 J6 = 1727010: Conn Term Block, 2POS, 3.81mm, TH; Manufacturer: Phoenix Contact; SymbolCreator: a0412235; CompType: Terminal Block; SymbolVersion: 2013-09-04; PartNumber: 1727010; PackageReference: 2POS Terminal Block; RoHS: Y; MountType: TH; ComponentLink1Description: Datasheet URL; ComponentLink1URL: http://eshop.phoenixcontact.com/phoenix/pdf.do?UID=1727010&general=usen; Publisher: Texas Instruments; LatestRevisionDate: 2017-01-19; Supplier 1: Digi-Key; Supplier Part Number 1: 277-1947-ND
LOGO2 = IEC_HotSurface: IEC 61010-1 Hot Surface Warning; SymbolCreator: a0412235; SymbolVersion: 2011-08-22; Published: 2009-03-03; Publisher: Texas Instruments; LatestRevisionDate: 2016-03-21
LOGO8 = IEC_HighVoltage: IEC 61010-1 High Voltage Warning; SymbolCreator: a0412235; SymbolVersion: 2011-08-22; Published: 2009-03-03; Publisher: Texas Instruments; LatestRevisionDate: 2016-03-21
Q5 = CSD19532Q5B: MOSFET, N-CH, 100 V, 17 A, DNK0008A (VSON-CLIP-8); Manufacturer: Texas Instruments; Alternate Manufacturer: None; U/M: EA; ChType: N; Value: 100V; VdsMax_V: 100; Value1: ? ohm; Value2: 48 nC; QgTyp_nC: 48; Vgs_V: 20; IdsMax_A: 17; SizeAreaWB_mm2: 56; SizeArea_mm2: 30; SizeX_mm: 6; SizeY_mm: 5; SizeZ_mm: 1; AEC Category: Q101; SymbolVersion: 2011-08-16; PartNumber: CSD19532Q5B; PackageReference: DNK0008A; CompType: MOSFET; RoHS: Y; MountType: SMT; Published: 2008-06-19; Publisher: Texas Instruments; LatestRevisionDate: 2017-06-26; LatestRevisionNote: Added parts.; ComponentLink1Description: Datasheet link; ComponentLink1URL: http://www.ti.com/lit/ds/symlink/csd19532q5b.pdf; Supplier 1: Digi-Key; Supplier Part Number 1: 296-37478-6-ND; Supplier 2: Farnell; Supplier Part Number 2: 2413268; AEC Qualified: N
Q6 = MMBT2907ALT1G, ON Semiconductor: Transistor, PNP, 60 V, 0.6 A, SOT-23; CompType: BJT; PNP: 1; NPN: 0; Vceo_V: 60; Vcesat1_V: 1.6; Value: 60 V; IcRated_A: 0.6; Value1: 0.6 A; TaMin_C: -55; TaMax_C: 150; SizeAreaWB_mm2: 14; SizeArea_mm2: 7.5; SizeX_mm: 2.5; SizeY_mm: 3; SizeZ_mm: 1.1; U/M: EA; AEC Category: Q101; Green_Lifecycle: Active; Green_REACh: Passed; SymbolVersion: 2008-07-31; PartNumber: MMBT2907ALT1G; Manufacturer: ON Semiconductor; PackageReference: SOT-23; RoHS: Y; Published: 2008-07-31; LatestRevisionDate: 2017-06-09; Publisher: Texas Instruments; ComponentLink1Description: Datasheet link; ComponentLink1URL: http://www.onsemi.com/pub_link/Collateral/MMBT2907ALT1-D.PDF; Supplier 1: Digi-Key; Supplier Part Number 1: MMBT2907ALT1GOSCT-ND; Supplier 2: Newark; Supplier Part Number 2: 88H4785; Supplier 3: Mouser; Supplier Part Number 3: 863-MMBT2907ALT1G; MountType: SMT; AEC Qualified: ?; Green_EU RoHS: Passed; Green_EU RoHS-2: Passed
Q7 Q8 = DNBT8105-7, Diodes Inc.: Transistor, NPN, 60 V, 1 A, AEC-Q101, SOT-23; CompType: BJT; PNP: 0; NPN: 1; Vceo_V: 60; Vcesat1_V: 0.25; Value: 60 V; Value1: 1 A; HfeMax: 300; TaMin_C: -55; TaMax_C: 150; SizeAreaWB_mm2: 14; SizeArea_mm2: 7.5; SizeX_mm: 2.5; SizeY_mm: 3; SizeZ_mm: 1.1; U/M: EA; AEC Category: Q101; AEC Qualified: Y; Green_Lifecycle: Not Set; Green_REACh: Incomplete; SymbolVersion: 2008-07-31; PartNumber: DNBT8105-7; Manufacturer: Diodes Inc.; PackageReference: SOT-23; RoHS: Y; IcRated_A: 1; Value2: 300; Published: 2008-07-31; LatestRevisionDate: 2017-06-09; Publisher: Texas Instruments; ComponentLink1Description: Datasheet link; ComponentLink1URL: https://www.diodes.com/assets/Datasheets/ds30513.pdf; Supplier 1: Digi-Key; Supplier Part Number 1: DNBT8105DICT-ND; Supplier 2: Newark; Supplier Part Number 2: 25R4543; Supplier 3: Mouser; Supplier Part Number 3: 621-DNBT8105-7; MountType: SMT; Green_EU RoHS: Incomplete; Green_EU RoHS-2: Incomplete
R21 = CRCW0603390KJNEA: RES, 390 k, 5%, 0.1 W, 0603; Manufacturer: Vishay-Dale; CompType: Resistor; Value: 390k; Res_ohm: 390000; Tolerance_%: 5; Power_W: 0.1; Value2: 0.1W; VDC_V: 75; TempCo: 200 ppm/C; SizeArea_mm2: 1.28; SizeX_mm: 1.6; SizeY_mm: 0.8; SizeZ_mm: 1; EIA_Code: E24; U/M: EA; AEC Category: Q200; SymbolVersion: 2009-05-29; PartNumber: CRCW0603390KJNEA; PackageReference: 0603; RoHS: Y; Value_Code: 390k; Value1: 5%; MountType: SMT; Technology: Thick Film; Published: 2008-06-26; Publisher: Texas Instruments; LatestRevisionDate: 2017-06-13; ComponentLink1Description: Datasheet link; ComponentLink1URL: http://www.vishay.com/docs/20035/dcrcwe3.pdf; Supplier 1: Digi-Key; Supplier Part Number 1: 541-390KGCT-ND; AEC Qualified: ?
R23 = CRCW04020000Z0ED: RES, 0, 5%, 0.063 W, 0402; Manufacturer: Vishay-Dale; CompType: Resistor; Value: 0; Value_Code: 0000; Tolerance_%: 5; Power_W: 0.063; Value2: 0.063W; VDC_V: 50; TempCo: 200 ppm/C; SizeArea_mm2: 0.5; SizeX_mm: 1; SizeZ_mm: 0.6; EIA_Code: E24; U/M: EA; AEC Category: Q200; Green_Lifecycle: Active; Green_REACh: Passed; SymbolVersion: 2009-05-29; PartNumber: CRCW04020000Z0ED; PackageReference: 0402; RoHS: Y; Res_ohm: 0; Value1: 5%; MountType: SMT; Technology: Thick Film; SizeY_mm: 0.5; Published: 2008-06-26; Publisher: Texas Instruments; LatestRevisionDate: 2017-06-12; ComponentLink1Description: Datasheet link; ComponentLink1URL: http://www.vishay.com/docs/20035/dcrcwe3.pdf; Supplier 1: Digi-Key; Supplier Part Number 1: 541-0.0JCT-ND; Supplier 2: Newark; Supplier Part Number 2: 52K6543; Supplier 3: Mouser; Supplier Part Number 3: 71-CRCW0402-0-E3; AEC Qualified: ?; Green_EU RoHS: Passed with Exemption; Green_EU RoHS-2: Passed
R30 R36 = CRCW1206470RJNEA: RES, 470, 5%, 0.25 W, 1206; Manufacturer: Vishay-Dale; CompType: Resistor; Value: 470; Value_Code: 470R; Tolerance_%: 5; Power_W: 0.25; Value2: 0.25W; VDC_V: 200; TempCo: 200 ppm/C; SizeArea_mm2: 5.12; SizeX_mm: 3.2; SizeY_mm: 1.6; SizeZ_mm: 1.35; EIA_Code: E24; U/M: EA; AEC Category: Q200; SymbolVersion: 2009-05-29; PartNumber: CRCW1206470RJNEA; PackageReference: 1206; RoHS: Y; Res_ohm: 470; Value1: 5%; MountType: SMT; Technology: Thick Film; Published: 2008-06-26; Publisher: Texas Instruments; LatestRevisionDate: 2017-06-12; ComponentLink1Description: Datasheet link; ComponentLink1URL: http://www.vishay.com/docs/20035/dcrcwe3.pdf; Supplier 1: Digi-Key; Supplier Part Number 1: 541-470ECT-ND; Supplier 2: Newark; Supplier Part Number 2: 59M6998; Supplier 3: Mouser; Supplier Part Number 3: 71-CRCW1206J-470-E3; AEC Qualified: ?
R31 = TNPW06035K11BEEA: RES, 5.11 k, 0.1%, 0.1 W, AEC-Q200 Grade 1, 0603; Manufacturer: Vishay-Dale; CompType: Resistor; Value: 5.11k; Res_ohm: 5110; Value_Code: 5k11; Tolerance_%: 0.1; Value2: 0.1W; VDC_V: 75; TempCo: 25 ppm/C; SizeArea_mm2: 1.36; SizeX_mm: 1.6; SizeY_mm: 0.85; SizeZ_mm: 0.55; EIA_Code: E192; U/M: EA; AEC Category: Q200; AEC Qualified: Y; AEC Grade: 1; SymbolVersion: 2009-05-29; PartNumber: TNPW06035K11BEEA; PackageReference: 0603; RoHS: Y; Value1: 0.1%; Power_W: 0.1; MountType: SMT; Technology: Thin Film; Published: 2008-06-26; Publisher: Texas Instruments; LatestRevisionDate: 2017-06-13; ComponentLink1Description: Datasheet link; ComponentLink1URL: http://www.vishay.com/docs/28758/tnpw_e3.pdf; Supplier 1: Digi-Key; Supplier Part Number 1: TNP5.11KAACT-ND; Supplier 2: Newark; Supplier Part Number 2: 05R3817; Supplier 3: Mouser; Supplier Part Number 3: 71-TNPW06035K11BEEA
R32 = CRCW20102K61FKEF: RES, 2.61 k, 1%, 0.75 W, AEC-Q200 Grade 0, 2010; Manufacturer: Vishay-Dale; CompType: Resistor; Value: 2.61k; Res_ohm: 2610; Value_Code: 2k61; Tolerance_%: 1; Power_W: 0.75; Value2: 0.75W; VDC_V: 400; TempCo: 100 ppm/C; SizeArea_mm2: 12.5; SizeX_mm: 5; SizeY_mm: 2.5; SizeZ_mm: 1.66; EIA_Code: E96; U/M: EA; AEC Category: Q200; AEC Qualified: Y; AEC Grade: 0; SymbolVersion: 2009-05-29; PartNumber: CRCW20102K61FKEF; PackageReference: 2010; RoHS: Y; Value1: 1%; MountType: SMT; Technology: Thick Film; Published: 2008-06-26; Publisher: Texas Instruments; LatestRevisionDate: 2017-04-20; ComponentLink1Description: Datasheet link; ComponentLink1URL: http://www.vishay.com/doc?20035; Supplier 1: Digi-Key; Supplier Part Number 1: 541-2.61KACCT-ND
R33 = CRCW0603402KFKEA: RES, 402 k, 1%, 0.1 W, 0603; Manufacturer: Vishay-Dale; CompType: Resistor; Value: 402k; Res_ohm: 402000; Tolerance_%: 1; Power_W: 0.1; Value2: 0.1W; VDC_V: 75; TempCo: 100 ppm/C; SizeArea_mm2: 1.28; SizeX_mm: 1.6; SizeY_mm: 0.8; EIA_Code: E96; U/M: EA; AEC Category: Q200; Green_Lifecycle: Active; Green_REACh: Passed; SymbolVersion: 2009-05-29; PartNumber: CRCW0603402KFKEA; PackageReference: 0603; RoHS: Y; Value_Code: 402k; Value1: 1%; MountType: SMT; Technology: Thick Film; SizeZ_mm: 1; Published: 2008-06-26; Publisher: Texas Instruments; LatestRevisionDate: 2017-06-13; ComponentLink1Description: Datasheet link; ComponentLink1URL: http://www.vishay.com/docs/20035/dcrcwe3.pdf; Supplier 1: Digi-Key; Supplier Part Number 1: 541-402KHCT-ND; Supplier 2: Newark; Supplier Part Number 2: 52K8511; Supplier 3: Mouser; Supplier Part Number 3: 71-CRCW0603-402K-E3; AEC Qualified: ?; Green_EU RoHS: Passed with Exemption; Green_EU RoHS-2: Passed
R34 = CRCW060310R0FKEAHP: RES, 10.0, 1%, 0.25 W, 0603; Manufacturer: Vishay-Dale; CompType: Resistor; Value: 10.0; Res_ohm: 10; Value_Code: 10R0; Tolerance_%: 1; Power_W: 0.25; Value2: 0.25W; VDC_V: 75; TempCo: 100 ppm/C; SizeArea_mm2: 1.28; SizeX_mm: 1.6; SizeY_mm: 0.8; EIA_Code: E96; U/M: EA; AEC Category: Q200; Green_Lifecycle: Active; Green_REACh: Passed; SymbolVersion: 2009-05-29; PartNumber: CRCW060310R0FKEAHP; PackageReference: 0603; RoHS: Y; Value1: 1%; MountType: SMT; Technology: Thick Film; SizeZ_mm: 1; Published: 2008-06-26; Publisher: Texas Instruments; LatestRevisionDate: 2017-06-13; ComponentLink1Description: Datasheet link; ComponentLink1URL: http://www.vishay.com/docs/20043/crcwhpe3.pdf; Supplier 1: Digi-Key; Supplier Part Number 1: 541-10.0SCT-ND; Supplier 2: Newark; Supplier Part Number 2: 24T7073; Supplier 3: Mouser; Supplier Part Number 3: 71-CRCW060310R0FKEAH; AEC Qualified: ?; Green_EU RoHS: Passed with Exemption; Green_EU RoHS-2: Passed
R35 = CRCW06031M00JNEA: RES, 1.0 M, 5%, 0.1 W, 0603; Manufacturer: Vishay-Dale; CompType: Resistor; Value: 1.0Meg; Res_ohm: 1000000; Value_Code: 1M00; Tolerance_%: 5; Power_W: 0.1; Value2: 0.1W; VDC_V: 75; TempCo: 200 ppm/C; SizeArea_mm2: 1.28; SizeX_mm: 1.6; SizeY_mm: 0.8; SizeZ_mm: 1; EIA_Code: E24; U/M: EA; AEC Category: Q200; Green_Lifecycle: Active; Green_REACh: Passed; SymbolVersion: 2009-05-29; PartNumber: CRCW06031M00JNEA; PackageReference: 0603; RoHS: Y; Value1: 5%; MountType: SMT; Technology: Thick Film; Published: 2008-06-26; Publisher: Texas Instruments; LatestRevisionDate: 2017-06-13; ComponentLink1Description: Datasheet link; ComponentLink1URL: http://www.vishay.com/docs/20035/dcrcwe3.pdf; Supplier 1: Digi-Key; Supplier Part Number 1: 541-1.0MGCT-ND; Supplier 2: Newark; Supplier Part Number 2: 59M6756; Supplier 3: Mouser; Supplier Part Number 3: 71-CRCW0603J-1.0M-E3; AEC Qualified: ?; Green_EU RoHS: Passed with Exemption; Green_EU RoHS-2: Passed
R37 = CRCW060366K5FKEA: RES, 66.5 k, 1%, 0.1 W, 0603; Manufacturer: Vishay-Dale; CompType: Resistor; Value: 66.5k; Res_ohm: 66500; Value_Code: 66k5; Tolerance_%: 1; Power_W: 0.1; Value2: 0.1W; VDC_V: 75; TempCo: 100 ppm/C; SizeArea_mm2: 1.28; SizeX_mm: 1.6; SizeY_mm: 0.8; EIA_Code: E96; U/M: EA; AEC Category: Q200; Green_Lifecycle: Active; Green_REACh: Passed; SymbolVersion: 2009-05-29; PartNumber: CRCW060366K5FKEA; PackageReference: 0603; RoHS: Y; Value1: 1%; MountType: SMT; Technology: Thick Film; SizeZ_mm: 1; Published: 2008-06-26; Publisher: Texas Instruments; LatestRevisionDate: 2017-06-13; ComponentLink1Description: Datasheet link; ComponentLink1URL: http://www.vishay.com/docs/20035/dcrcwe3.pdf; Supplier 1: Digi-Key; Supplier Part Number 1: 541-66.5KHCT-ND; Supplier 2: Newark; Supplier Part Number 2: 52K8670; Supplier 3: Mouser; Supplier Part Number 3: 71-CRCW0603-66.5K-E3; AEC Qualified: ?; Green_EU RoHS: Passed with Exemption; Green_EU RoHS-2: Passed
R38 = CRCW06034R70JNEA: RES, 4.7, 5%, 0.1 W, 0603; Manufacturer: Vishay-Dale; CompType: Resistor; Value: 4.7; Value_Code: 4R70; Tolerance_%: 5; Power_W: 0.1; Value2: 0.1W; VDC_V: 75; TempCo: 200 ppm/C; SizeArea_mm2: 1.28; SizeX_mm: 1.6; SizeY_mm: 0.8; SizeZ_mm: 1; EIA_Code: E24; U/M: EA; AEC Category: Q200; Green_Lifecycle: Active; Green_REACh: Passed; SymbolVersion: 2009-05-29; PartNumber: CRCW06034R70JNEA; PackageReference: 0603; RoHS: Y; Res_ohm: 4.7; Value1: 5%; MountType: SMT; Technology: Thick Film; Published: 2008-06-26; Publisher: Texas Instruments; LatestRevisionDate: 2017-06-13; ComponentLink1Description: Datasheet link; ComponentLink1URL: http://www.vishay.com/docs/20035/dcrcwe3.pdf; Supplier 1: Digi-Key; Supplier Part Number 1: 541-4.7GCT-ND; Supplier 2: Newark; Supplier Part Number 2: 59M6813; Supplier 3: Mouser; Supplier Part Number 3: 71-CRCW0603J-4.7-E3; AEC Qualified: ?; Green_EU RoHS: Passed with Exemption; Green_EU RoHS-2: Passed
R39 = CRCW0603191KFKEA: RES, 191 k, 1%, 0.1 W, 0603; Manufacturer: Vishay-Dale; CompType: Resistor; Value: 191k; Res_ohm: 191000; Tolerance_%: 1; Power_W: 0.1; Value2: 0.1W; VDC_V: 75; TempCo: 100 ppm/C; SizeArea_mm2: 1.28; SizeX_mm: 1.6; SizeY_mm: 0.8; EIA_Code: E96; U/M: EA; AEC Category: Q200; Green_Lifecycle: Active; Green_REACh: Passed; SymbolVersion: 2009-05-29; PartNumber: CRCW0603191KFKEA; PackageReference: 0603; RoHS: Y; Value_Code: 191k; Value1: 1%; MountType: SMT; Technology: Thick Film; SizeZ_mm: 1; Published: 2008-06-26; Publisher: Texas Instruments; LatestRevisionDate: 2017-06-13; ComponentLink1Description: Datasheet link; ComponentLink1URL: http://www.vishay.com/docs/20035/dcrcwe3.pdf; Supplier 1: Digi-Key; Supplier Part Number 1: 541-191KHCT-ND; Supplier 2: Newark; Supplier Part Number 2: 52K8218; Supplier 3: Mouser; Supplier Part Number 3: 71-CRCW0603-191K-E3; AEC Qualified: ?; Green_EU RoHS: Passed with Exemption; Green_EU RoHS-2: Passed
R40 = CRCW0603300RJNEA: RES, 300, 5%, 0.1 W, 0603; Manufacturer: Vishay-Dale; CompType: Resistor; Value: 300; Value_Code: 300R; Tolerance_%: 5; Power_W: 0.1; Value2: 0.1W; VDC_V: 75; TempCo: 200 ppm/C; SizeArea_mm2: 1.28; SizeX_mm: 1.6; SizeY_mm: 0.8; SizeZ_mm: 1; EIA_Code: E24; U/M: EA; AEC Category: Q200; Green_Lifecycle: Active; Green_REACh: Passed; SymbolVersion: 2009-05-29; PartNumber: CRCW0603300RJNEA; PackageReference: 0603; RoHS: Y; Res_ohm: 300; Value1: 5%; MountType: SMT; Technology: Thick Film; Published: 2008-06-26; Publisher: Texas Instruments; LatestRevisionDate: 2017-06-13; ComponentLink1Description: Datasheet link; ComponentLink1URL: http://www.vishay.com/docs/20035/dcrcwe3.pdf; Supplier 1: Digi-Key; Supplier Part Number 1: 541-300GCT-ND; Supplier 2: Newark; Supplier Part Number 2: 59M6801; Supplier 3: Mouser; Supplier Part Number 3: 71-CRCW0603J-300-E3; AEC Qualified: ?; Green_EU RoHS: Passed with Exemption; Green_EU RoHS-2: Passed
R41 = ERJ-3GEYJ222V: RES, 2.2 k, 5%, 0.1 W, AEC-Q200 Grade 0, 0603; Manufacturer: Panasonic; CompType: Resistor; Value: 2.2k; Res_ohm: 2200; Value_Code: 2k20; Tolerance_%: 5; Power_W: 0.1; Value2: 0.1W; VDC_V: 75; TempCo: 200 ppm/C; SizeArea_mm2: 1.28; SizeX_mm: 1.6; SizeY_mm: 0.8; SizeZ_mm: 1; EIA_Code: E24; U/M: EA; AEC Category: Q200; AEC Qualified: Y; AEC Grade: 0; Green_Lifecycle: Active; Green_REACh: Passed; SymbolVersion: 2009-05-29; PartNumber: ERJ-3GEYJ222V; PackageReference: 0603; RoHS: Y; Value1: 5%; MountType: SMT; Technology: Thick Film; Published: 2008-06-26; Publisher: Texas Instruments; LatestRevisionDate: 2017-06-13; ComponentLink1Description: Datasheet link; ComponentLink1URL: https://industrial.panasonic.com/cdbs/www-data/pdf/RDA0000/AOA0000C281.pdf; Supplier 1: Digi-Key; Supplier Part Number 1: P2.2KGCT-ND; Supplier 2: Newark; Supplier Part Number 2: 65T8604; Supplier 3: Mouser; Supplier Part Number 3: 667-ERJ-3GEYJ222V; Green_EU RoHS: Passed with Exemption; Green_EU RoHS-2: Passed
R42 = WSL2010R0150FEA18: RES, 0.015, 1%, 1 W, 2010; Manufacturer: Vishay-Dale; CompType: Resistor; Value: 0.015; Value_Code: R015; Tolerance_%: 1; Value2: 1W; TempCo: 75 ppm/C; SizeArea_mm2: 12.5; SizeX_mm: 5; SizeY_mm: 2.5; SizeZ_mm: 1.66; EIA_Code: E96; U/M: EA; AEC Category: Q200; SymbolVersion: 2009-05-29; PartNumber: WSL2010R0150FEA18; PackageReference: 2010; RoHS: Y; Res_ohm: 0.015; Value1: 1%; Power_W: 1; MountType: SMT; Technology: Metal Film; Published: 2008-06-26; Publisher: Texas Instruments; LatestRevisionDate: 2017-04-20; ComponentLink1Description: Datasheet link; ComponentLink1URL: http://www.vishay.com/docs/31057/wslhigh.pdf; Supplier 1: Digi-Key; Supplier Part Number 1: WSLF-.015CT-ND; Supplier 2: Mouser; Supplier Part Number 2: 71-WSL2010R0150FEA18; Supplier 3: Farnell; Supplier Part Number 3: 1107365; AEC Qualified: ?
R43 = RT0603DRE07172KL: RES, 172 k, 0.5%, 0.1 W, 0603; Manufacturer: Yageo America; CompType: Resistor; Value: 172k; Res_ohm: 172000; Tolerance_%: 0.5; Power_W: 0.1; Value2: 0.1W; VDC_V: 75; TempCo: 50 ppm/C; SizeArea_mm2: 1.28; SizeX_mm: 1.6; SizeY_mm: 0.8; SizeZ_mm: 1; EIA_Code: E192; U/M: EA; AEC Category: Q200; SymbolVersion: 2009-05-29; PartNumber: RT0603DRE07172KL; PackageReference: 0603; RoHS: Y; Value_Code: 172k; Value1: 0.5%; MountType: SMT; Technology: Thin Film; Published: 2008-06-26; Publisher: Texas Instruments; LatestRevisionDate: 2017-06-13; ComponentLink1Description: Datasheet link; ComponentLink1URL: http://www.yageo.com/pdf/PYu-RT_1-to-0.05_RoHS_L_3.pdf; AEC Qualified: ?
R44 = CRCW060322K0JNEA: RES, 22 k, 5%, 0.1 W, 0603; Manufacturer: Vishay-Dale; CompType: Resistor; Value: 22k; Res_ohm: 22000; Value_Code: 22k0; Tolerance_%: 5; Power_W: 0.1; Value2: 0.1W; VDC_V: 75; TempCo: 200 ppm/C; SizeArea_mm2: 1.28; SizeX_mm: 1.6; SizeY_mm: 0.8; SizeZ_mm: 1; EIA_Code: E24; U/M: EA; AEC Category: Q200; Green_Lifecycle: Active; Green_REACh: Passed; SymbolVersion: 2009-05-29; PartNumber: CRCW060322K0JNEA; PackageReference: 0603; RoHS: Y; Value1: 5%; MountType: SMT; Technology: Thick Film; Published: 2008-06-26; Publisher: Texas Instruments; LatestRevisionDate: 2017-06-13; ComponentLink1Description: Datasheet link; ComponentLink1URL: http://www.vishay.com/docs/20035/dcrcwe3.pdf; Supplier 1: Digi-Key; Supplier Part Number 1: 541-22KGCT-ND; Supplier 2: Newark; Supplier Part Number 2: 59M6786; Supplier 3: Mouser; Supplier Part Number 3: 71-CRCW0603J-22K-E3; AEC Qualified: ?; Green_EU RoHS: Passed with Exemption; Green_EU RoHS-2: Passed
R45 = CRCW060310K0FKEA: RES, 10.0 k, 1%, 0.1 W, 0603; Manufacturer: Vishay-Dale; CompType: Resistor; Value: 10.0k; Res_ohm: 10000; Value_Code: 10k0; Tolerance_%: 1; Power_W: 0.1; Value2: 0.1W; VDC_V: 75; TempCo: 100 ppm/C; SizeArea_mm2: 1.28; SizeX_mm: 1.6; SizeY_mm: 0.8; EIA_Code: E96; U/M: EA; AEC Category: Q200; Green_Lifecycle: Active; Green_REACh: Passed; SymbolVersion: 2009-05-29; PartNumber: CRCW060310K0FKEA; PackageReference: 0603; RoHS: Y; Value1: 1%; MountType: SMT; Technology: Thick Film; SizeZ_mm: 1; Published: 2008-06-26; Publisher: Texas Instruments; LatestRevisionDate: 2017-06-13; ComponentLink1Description: Datasheet link; ComponentLink1URL: http://www.vishay.com/docs/20035/dcrcwe3.pdf; Supplier 1: Digi-Key; Supplier Part Number 1: 541-10.0KHCT-ND; Supplier 2: Newark; Supplier Part Number 2: 52K8062; Supplier 3: Mouser; Supplier Part Number 3: 71-CRCW0603-10K-E3; AEC Qualified: ?; Green_EU RoHS: Passed with Exemption; Green_EU RoHS-2: Passed
R47 = CRCW06031K00JNEA: RES, 1.0 k, 5%, 0.1 W, 0603; Manufacturer: Vishay-Dale; CompType: Resistor; Value: 1.0k; Res_ohm: 1000; Value_Code: 1k00; Tolerance_%: 5; Power_W: 0.1; Value2: 0.1W; VDC_V: 75; TempCo: 200 ppm/C; SizeArea_mm2: 1.28; SizeX_mm: 1.6; SizeY_mm: 0.8; SizeZ_mm: 1; EIA_Code: E24; U/M: EA; AEC Category: Q200; Green_Lifecycle: Active; Green_REACh: Passed; SymbolVersion: 2009-05-29; PartNumber: CRCW06031K00JNEA; PackageReference: 0603; RoHS: Y; Value1: 5%; MountType: SMT; Technology: Thick Film; Published: 2008-06-26; Publisher: Texas Instruments; LatestRevisionDate: 2017-06-13; ComponentLink1Description: Datasheet link; ComponentLink1URL: http://www.vishay.com/docs/20035/dcrcwe3.pdf; Supplier 1: Digi-Key; Supplier Part Number 1: 541-1.0KGCT-ND; Supplier 2: Newark; Supplier Part Number 2: 59M6750; Supplier 3: Mouser; Supplier Part Number 3: 71-CRCW0603J-1.0K-E3; AEC Qualified: ?; Green_EU RoHS: Passed with Exemption; Green_EU RoHS-2: Passed
R49 R53 R56 = CRCW20100000Z0EF: RES, 0, 5%, 0.75 W, AEC-Q200 Grade 0, 2010; Manufacturer: Vishay-Dale; CompType: Resistor; Value: 0; Value_Code: 0000; Tolerance_%: 5; Power_W: 0.75; Value2: 0.75W; TempCo: ppm/C; SizeArea_mm2: 12.5; SizeY_mm: 2.5; SizeZ_mm: 1.66; EIA_Code: E24; U/M: EA; AEC Category: Q200; AEC Qualified: Y; SymbolVersion: 2009-05-29; PartNumber: CRCW20100000Z0EF; PackageReference: 2010; RoHS: Y; Res_ohm: 0; Value1: 5%; MountType: SMT; Technology: Thick Film; SizeX_mm: 5; Published: 2008-06-26; Publisher: Texas Instruments; LatestRevisionDate: 2017-04-20; ComponentLink1Description: Datasheet link; ComponentLink1URL: http://www.vishay.com/doc?20035; Supplier 1: Digi-Key; Supplier Part Number 1: 541-0.0WCT-ND; AEC Grade: 0
R51 = CRCW120647K0JNEA: RES, 47 k, 5%, 0.25 W, 1206; Manufacturer: Vishay-Dale; CompType: Resistor; Value: 47k; Res_ohm: 47000; Value_Code: 47k0; Tolerance_%: 5; Power_W: 0.25; Value2: 0.25W; VDC_V: 200; TempCo: 200 ppm/C; SizeArea_mm2: 5.12; SizeX_mm: 3.2; SizeY_mm: 1.6; SizeZ_mm: 1.35; EIA_Code: E24; U/M: EA; AEC Category: Q200; SymbolVersion: 2009-05-29; PartNumber: CRCW120647K0JNEA; PackageReference: 1206; RoHS: Y; Value1: 5%; MountType: SMT; Technology: Thick Film; Published: 2008-06-26; Publisher: Texas Instruments; LatestRevisionDate: 2017-06-12; ComponentLink1Description: Datasheet link; ComponentLink1URL: http://www.vishay.com/docs/20035/dcrcwe3.pdf; Supplier 1: Digi-Key; Supplier Part Number 1: 541-47KECT-ND; Supplier 2: Newark; Supplier Part Number 2: 59M6996; Supplier 3: Mouser; Supplier Part Number 3: 71-CRCW1206J-47K-E3; AEC Qualified: ?
R57 R58 = RC0603JR-0747KL: RES, 47 k, 5%, 0.1 W, 0603; Manufacturer: Yageo America; CompType: Resistor; Value: 47k; Res_ohm: 47000; Value_Code: 47k0; Tolerance_%: 5; Power_W: 0.1; Value2: 0.1W; VDC_V: 50; TempCo: 100 ppm/C; SizeArea_mm2: 1.28; SizeX_mm: 1.6; SizeY_mm: 0.8; SizeZ_mm: 1; EIA_Code: E24; U/M: EA; AEC Category: Q200; Green_Lifecycle: Active; Green_REACh: Passed; SymbolVersion: 2009-05-29; PartNumber: RC0603JR-0747KL; PackageReference: 0603; RoHS: Y; Value1: 5%; MountType: SMT; Technology: Thick Film; Published: 2008-06-26; Publisher: Texas Instruments; LatestRevisionDate: 2017-06-13; ComponentLink1Description: Datasheet link; ComponentLink1URL: http://www.yageo.com/pdf/Pu-RC0603_51_PbFree_L_2.pdf; Supplier 1: Digi-Key; Supplier Part Number 1: 311-47KGRCT-ND; Supplier 2: Mouser; Supplier Part Number 2: 603-RC0603JR-0747KL; Supplier 3: Farnell; Supplier Part Number 3: 9233580; AEC Qualified: ?; Green_EU RoHS: Passed with Exemption; Green_EU RoHS-2: Passed
T2 = CMP-0081056-1: Transformer, 13 uH, TH; Manufacturer: Wurth Elektronik; LeakageInd_H: 300nH; Rsec2_ohm: 1.45; SizeAreaWB_mm2: 379.25; DCR_ohm: 0.022; Value: 13uH; Lp: 13; SizeZ_mm: 18.8; SizeX_mm: 16.5; SizeY_mm: 18.5; Ns1toNp: 5.5; SizeArea_mm2: 305.25; Ind_H: 13µH; AEC Qualified: N; Rsec1_ohm: 1; AEC Category: Q200; ComponentLink1URL: https://sps16.itg.ti.com/sites/KMS/crossdivteams/altium/docs/ComponentDatasheets/750343772,Rev00(For TI India, EE16, Two outputs, 20W).pdf; RoHS: Y; MountType: TH; PackageReference: 16.5x18.5mm; CompType: Transformer; Ns2toNp: 5.5; PartNumber: 750343772; ComponentLink1Description: Datasheet URL; AEC Grade: N/A; ValueDisplayed: 13µH
TP5-TP8 = 5002: Test Point, Miniature, White, TH; Manufacturer: Keystone; CompType: Test Point Loop; ContactFinish: Silver; SymbolVersion: 2008-04-04; PartNumber: 5002; PackageReference: White Miniature Testpoint; RoHS: Y; MountType: TH; ComponentLink1Description: Datasheet URL; ComponentLink1URL: http://www.keyelco.com/userAssets/file/M60-2p60.pdf; Color: White; Publisher: Texas Instruments; LatestRevisionDate: 2016-09-27; Supplier 1: Digi-Key; Supplier Part Number 1: 36-5002-ND; Supplier 2: Mouser; Supplier Part Number 2: 534-5002; Supplier 3: Newark; Supplier Part Number 3: 82H9632
U4 = LM3481MMX/NOPB: High Efficiency Low-Side N-Channel Controller for Switching Regulators, 10-pin MSOP, Pb-Free; Manufacturer: Texas Instruments; PackageTopMarking: ZXTT*SJPB; PowerWise: N; CompType: MiscPower; Published: 1-Mar-2010; DatasheetVersion: Nov-2007; PackageVersion: revB, Jul-2003; PackageReference: MUB10A; Publisher: Altium Limited; PackageDescription: Mini-SO, Molded, .118 x .118 x .034in Body, 10 Lead, .0197in Pitch; Supplier 1: Digi-Key; Supplier Part Number 1: LM3481MMX-ND; PartNumber: LM3481MMX/NOPB; RoHS: Y; PinCount: 10; Code_JEDEC: MO-187-BA; ComponentLink1Description: LM3481 Datasheet; ComponentLink1URL: http://www.national.com/ds/LM/LM3481.pdf; ComponentLink2Description: LM3481 Web Page; ComponentLink2URL: http://www.national.com/pf/LM/LM3481.html; ComponentLink3Description: MUB10A Package Page; ComponentLink3URL: http://www.national.com/packaging/folders/mub10a.html
U5 = TLV171IDBVR: 36V, Low-Power, RRO, General-Purpose Operational Amplifier, DBV0005A (SOT-23-5); Alternate PartNumber: TLV171IDBVT; Manufacturer: Texas Instruments; SizeArea_mm2: 8.12; SizeAreaWB_mm2: 14.82; SizeX_mm: 2.8; SizeY_mm: 2.9; SizeZ_mm: 1.45; CompType: IC; U/M: EA; SymbolVersion: 2008-11-25; PartNumber: TLV171IDBVR; PackageReference: DBV0005A; PackageDescription: SOT-23-5; MountType: SMT; ComponentLink1Description: Datasheet Link; ComponentLink1URL: http://www.ti.com/lit/ds/symlink/tlv171.pdf; RoHS: Y; Publisher: Texas Instruments; LatestRevisionDate: 2017-05-22; Alternate Manufacturer: Texas Instruments